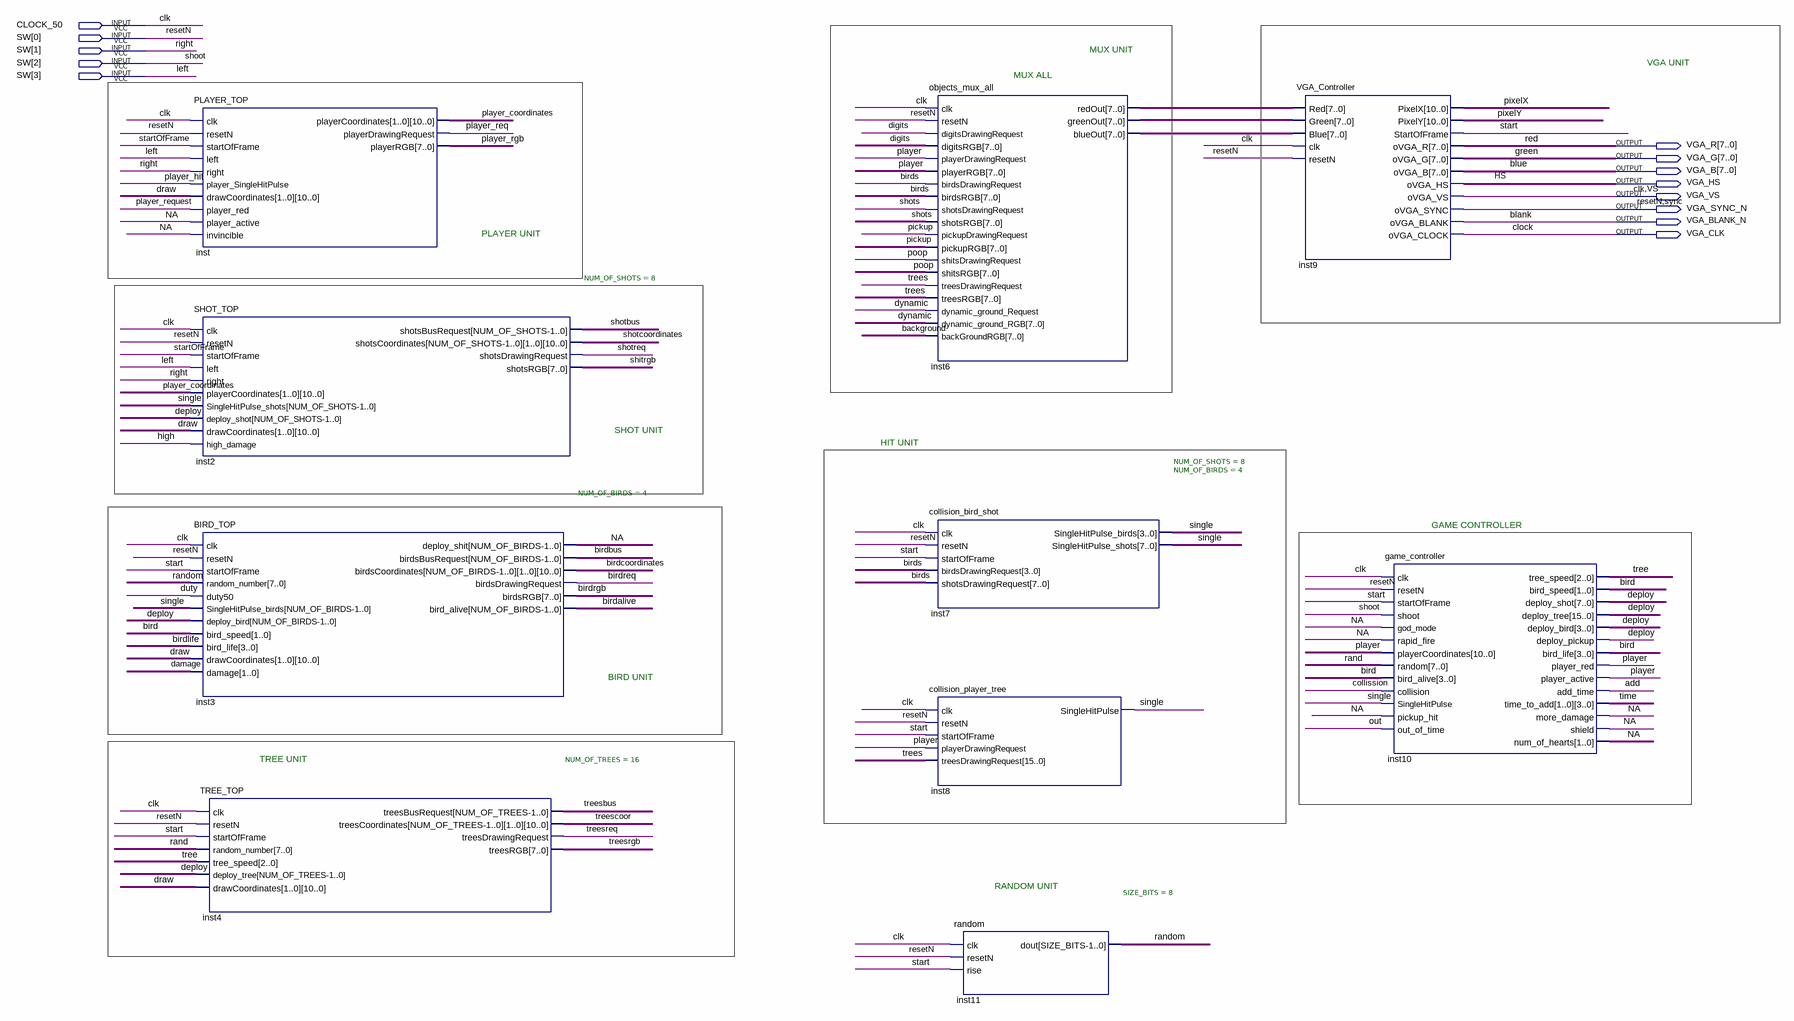
[diagram p0: schematic sheet]
// Quartus schematic Lab1Demo.bdf as structural Verilog: 10 symbols, 13 pins
module Lab1Demo (
  input  CLOCK_50,
  input  [3:0] SW,
  output [7:0] VGA_R,
  output [7:0] VGA_G,
  output [7:0] VGA_B,
  output VGA_HS,
  output VGA_VS,
  output VGA_SYNC_N,
  output VGA_BLANK_N,
  output VGA_CLK
);

  wire add, background, bird, birdalive, birdbus, birdcoordinates, birdlife, birdreq, birdrgb, birds, blue,
       collission, damage, deploy, digits, draw, duty, dynamic, green, high, NA, out, pickup, pixelX, pixelY,
       player, player_coordinates, player_hit, player_req, player_request, player_rgb, poop, \rand , random,
       red, shitrgb, shotbus, shotcoordinates, shotreq, shots, single, start, startOfFrame, sync, \time ,
       tree, trees, treesbus, treescoor, treesreq, treesrgb, VS;
  wire [7:0] inst6_blueout, inst6_greenout, inst6_redout;

  PLAYER_TOP inst (
    .clk(CLOCK_50), .resetN(SW[0]), .startOfFrame(startOfFrame), .left(SW[3]), .right(SW[1]),
    .player_SingleHitPulse(player_hit), .drawCoordinates({22{draw}}), .player_red(player_request),
    .player_active(NA), .invincible(NA), .playerCoordinates(player_coordinates),
    .playerDrawingRequest(player_req), .playerRGB(player_rgb));
  SHOT_TOP #(.NUM_OF_SHOTS(8)) inst2 (
    .clk(CLOCK_50), .resetN(SW[0]), .startOfFrame(startOfFrame), .left(SW[3]), .right(SW[1]),
    .playerCoordinates({22{player_coordinates}}), .SingleHitPulse_shots({8{single}}),
    .deploy_shot({8{deploy}}), .drawCoordinates({22{draw}}), .high_damage(high), .shotsBusRequest(shotbus),
    .shotsCoordinates(shotcoordinates), .shotsDrawingRequest(shotreq), .shotsRGB(shitrgb));
  BIRD_TOP #(.NUM_OF_BIRDS(4)) inst3 (
    .clk(CLOCK_50), .resetN(SW[0]), .startOfFrame(start), .random_number({8{random}}), .duty50(duty),
    .SingleHitPulse_birds({4{single}}), .deploy_bird({4{deploy}}), .bird_speed({2{bird}}),
    .bird_life({4{birdlife}}), .drawCoordinates({22{draw}}), .damage({2{damage}}), .deploy_shit(NA),
    .birdsBusRequest(birdbus), .birdsCoordinates(birdcoordinates), .birdsDrawingRequest(birdreq),
    .birdsRGB(birdrgb), .bird_alive(birdalive));
  TREE_TOP #(.NUM_OF_TREES(16)) inst4 (
    .clk(CLOCK_50), .resetN(SW[0]), .startOfFrame(start), .random_number({8{\rand }}),
    .tree_speed({3{tree}}), .deploy_tree({16{deploy}}), .drawCoordinates({22{draw}}),
    .treesBusRequest(treesbus), .treesCoordinates(treescoor), .treesDrawingRequest(treesreq),
    .treesRGB(treesrgb));
  objects_mux_all inst6 (
    .clk(CLOCK_50), .resetN(SW[0]), .digitsDrawingRequest(digits), .digitsRGB({8{digits}}),
    .playerDrawingRequest(player), .playerRGB({8{player}}), .birdsDrawingRequest(birds),
    .birdsRGB({8{birds}}), .shotsDrawingRequest(shots), .shotsRGB({8{shots}}), .pickupDrawingRequest(pickup),
    .pickupRGB({8{pickup}}), .shitsDrawingRequest(poop), .shitsRGB({8{poop}}), .treesDrawingRequest(trees),
    .treesRGB({8{trees}}), .dynamic_ground_Request(dynamic), .dynamic_ground_RGB({8{dynamic}}),
    .backGroundRGB({8{background}}), .redOut(inst6_redout), .greenOut(inst6_greenout), .blueOut(inst6_blueout));
  collision_bird_shot #(.NUM_OF_SHOTS(8), .NUM_OF_BIRDS(4)) inst7 (
    .clk(CLOCK_50), .resetN(SW[0]), .startOfFrame(start), .birdsDrawingRequest({4{birds}}),
    .shotsDrawingRequest({8{birds}}), .SingleHitPulse_birds(single), .SingleHitPulse_shots(single));
  collision_player_tree inst8 (
    .clk(CLOCK_50), .resetN(SW[0]), .startOfFrame(start), .playerDrawingRequest(player),
    .treesDrawingRequest({16{trees}}), .SingleHitPulse(single));
  random #(.SIZE_BITS(8)) inst11 (.clk(CLOCK_50), .resetN(SW[0]), .rise(start), .dout(random));
  VGA_Controller inst9 (
    .Red(inst6_redout), .Green(inst6_greenout), .Blue(inst6_blueout), .clk(CLOCK_50), .resetN(SW[0]),
    .PixelX(pixelX), .PixelY(pixelY), .StartOfFrame(start), .oVGA_R(red), .oVGA_G(green), .oVGA_B(blue),
    .oVGA_HS(VGA_HS), .oVGA_VS({CLOCK_50, VS}), .oVGA_SYNC({SW[0], sync}), .oVGA_BLANK(VGA_BLANK_N),
    .oVGA_CLOCK(VGA_CLK));
  game_controller inst10 (
    .clk(CLOCK_50), .resetN(SW[0]), .startOfFrame(start), .shoot(SW[2]), .god_mode(NA), .rapid_fire(NA),
    .playerCoordinates({11{player}}), .random({8{\rand }}), .bird_alive({4{bird}}), .collision(collission),
    .SingleHitPulse(single), .pickup_hit(NA), .out_of_time(out), .tree_speed(tree), .bird_speed(bird),
    .deploy_shot(deploy), .deploy_tree(deploy), .deploy_bird(deploy), .deploy_pickup(deploy),
    .bird_life(bird), .player_red(player), .player_active(player), .add_time(add), .time_to_add(\time ),
    .more_damage(NA), .shield(NA), .num_of_hearts(NA));

  // Other names for the same wires on the sheet: blank = VGA_BLANK_N; clk = CLOCK_50; clock = VGA_CLK; HS = VGA_HS;
  //   left = SW[3]; resetN = SW[0]; right = SW[1]; shoot = SW[2]

  // Notes on the sheet:
  //   MUX UNIT
  //   VGA UNIT
  //   MUX ALL
  //   PLAYER UNIT
  //   SHOT UNIT
  //   HIT UNIT
  //   GAME CONTROLLER
  //   BIRD UNIT
  //   TREE UNIT
  //   RANDOM UNIT
endmodule
